# Altium schematic sheet uARM.SchDoc
size A
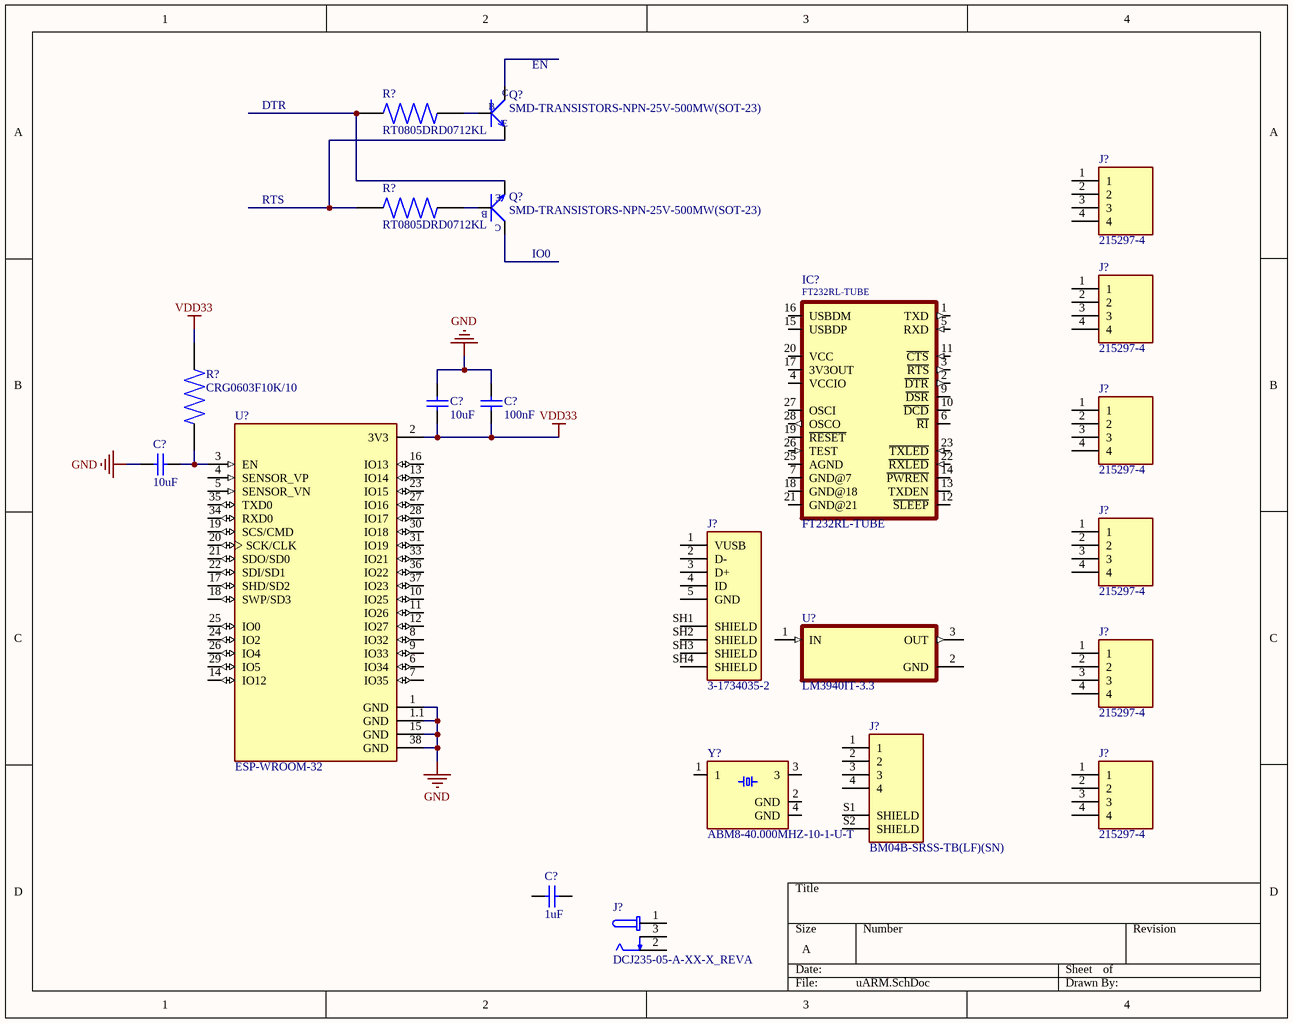
[diagram p0: uARM.SchDoc]

## Parts
(Parts that share a designator on the sheet are numbered #1, #2 ... from top to bottom, then left to right.)
C?#1  value 10uF  [C_3216[1206]_N]  (hidden comment: C1206C106K3RACTU)
C?#2  value 100nF  [C_3216[1206]_N]  (hidden comment: C1206C106K3RACTU)
C?#3  value 10uF  [C_3216[1206]_N]  (hidden comment: C1206C106K3RACTU)
C?#4  value 1uF  [C_3216[1206]_N]  (hidden comment: C1206C106K3RACTU)
IC?  FT232RL-TUBE  [SSOP28-LD]
J?#1  215297-4  [TE_215297-4]
J?#2  215297-4  [TE_215297-4]
J?#3  215297-4  [TE_215297-4]
J?#4  215297-4  [TE_215297-4]
J?#5  3-1734035-2  [TE_3-1734035-2]
J?#6  215297-4  [TE_215297-4]
J?#7  BM04B-SRSS-TB(LF)(SN)  [CONN_BM04B-SRSS-TB(LF)(SN)]
J?#8  215297-4  [TE_215297-4]
J?#9  DCJ235-05-A-XX-X_REVA  [GCT_DCJ235-05-A-XX-X_REVA]
Q?#1  SMD-TRANSISTORS-NPN-25V-500MW(SOT-23)  [SOT-23]
Q?#2  SMD-TRANSISTORS-NPN-25V-500MW(SOT-23)  [SOT-23]
R?#1  RT0805DRD0712KL  [RESC2012X60N]
R?#2  RT0805DRD0712KL  [RESC2012X60N]
R?#3  CRG0603F10K/10  [RESC1608X55N]
U?#1  ESP-WROOM-32  [MODULE_ESP-WROOM-32]
U?#2  LM3940IT-3.3  [TO254P1054X470X1955-3]
Y?  ABM8-40.000MHZ-10-1-U-T  [OSCSC320X250X100N]

## Nets
GND: C?#1.2 C?#2.2 C?#3.2 U?#1.1(GND) U?#1.1.1(GND) U?#1.15(GND) U?#1.38(GND)
VDD33: C?#1.1 C?#2.1 R?#3.2 U?#1.2(3V3)
NetC?#3_1: C?#3.1 R?#3.1 U?#1.3(EN)
NetQ?#1_1: Q?#1.1(B) R?#1.2
NetQ?#1_2: Q?#1.2(E) R?#2.1
NetQ?#2_1: Q?#2.1(B) R?#2.2
NetQ?#2_2: Q?#2.2(E) R?#1.1

Not connected (* = marked no-connect by the designer): C?#4 1 2; IC? 1(TXD) 2(~{DTR}) 3(~{RTS}) 4(VCCIO) 5(RXD) 6(~{RI}) 7(GND@7) 9(~{DSR}) 10(~{DCD}) 11(~{CTS}) 12(~{SLEEP}) 13(TXDEN) 14(~{PWREN}) 15(USBDP) 16(USBDM) 17(3V3OUT) 18(GND@18) 19(~{RESET}) 20(VCC) 21(GND@21) 22(~{RXLED}) 23(~{TXLED}) 25(AGND) 26(TEST) 27(OSCI) 28(OSCO); J?#1 1 2 3 4; J?#2 1 2 3 4; J?#3 1 2 3 4; J?#4 1 2 3 4; J?#5 1(VUSB) 2(D-) 3(D+) 4(ID) 5(GND) SH1(SHIELD) SH2(SHIELD) SH3(SHIELD) SH4(SHIELD); J?#6 1 2 3 4; J?#7 1 2 3 4 S1(SHIELD) S2(SHIELD); J?#8 1 2 3 4; J?#9 1 2 3; Q?#1 3(C); Q?#2 3(C); U?#1 4(SENSOR_VP) 5(SENSOR_VN) 6(IO34) 7(IO35) 8(IO32) 9(IO33) 10(IO25) 11(IO26) 12(IO27) 13(IO14) 14(IO12) 16(IO13) 17(SHD/SD2) 18(SWP/SD3) 19(SCS/CMD) 20(SCK/CLK) 21(SDO/SD0) 22(SDI/SD1) 23(IO15) 24(IO2) 25(IO0) 26(IO4) 27(IO16) 28(IO17) 29(IO5) 30(IO18) 31(IO19) 33(IO21) 34(RXD0) 35(TXD0) 36(IO22) 37(IO23); U?#2 1(IN) 2(GND) 3(OUT); Y? 1 2(GND) 3 4(GND)

## Notes on the sheet
- (near Q?#1) EN
- DTR
- RTS
- (near Q?#2) IO0

## Library data of the parts
C?#1-C?#4 = C_10uf_3216[1206]: Capacitor Céramique 10uf XR7 25V 10%; Manufacturer: KEMET; ManufacturerPartNumber: C1206C106K3RACTU; Supplier 1: Digi-Key; Supplier Part Number 1: 399-7442-1-ND; MountingType: SMT
IC? = FT232RL-TUBE: MF: {'manufacturer': u'FTDI,'}; Value: *; MP: FT232RL-TUBE; Availability: Unavailable; Price: None; Package: None
J?#1-J?#4 J?#6 J?#8 = 215297-4: MF: {'manufacturer': u'TE Connectivity'}; Package: None; Price: None; Availability: Unavailable; MP: 215297-4; Value: *
J?#5 = 3-1734035-2: USB Connectors MINI USB, R/A, SMT, MATTE TIN, W/O MYLAR; MF: {'manufacturer': u'TE Connectivity'}; Value: *; MP: 3-1734035-2; Availability: Unavailable; Price: None; Package: None
J?#7 = BM04B-SRSS-TB(LF)(SN): BM04B Series 1 mm Pitch 4 Position SMT Single Row Top Entry Shrouded Header; MF: {'manufacturer': u'JST Sales'}; Availability: Unavailable; Price: None; Value: *; MP: BM04B-SRSS-TB(LF)(SN); Package: None
J?#9 = DCJ235-05-A-XX-X_REVA: DC Power Jack, Thru-Hole, Horizontal, with Locating Pegs, D2.35mm; MF: {'manufacturer': u'Global Connector Technology'}; Availability: Unavailable; Package: None; Price: None; MP: DCJ235-05-A-XX-X_REVA; Value: *
Q?#1 Q?#2 = SMD-TRANSISTORS-NPN-25V-500MW(SOT-23): 305010017; MP: S8050; MF: {'manufacturer': u'Microdiode Electronics'}; Availability: Unavailable; Package: None; Value: *; Price: None
R?#1 R?#2 = RT0805DRD0712KL: RES SMD 12K OHM 0.5% 1/8W 0805; MF: {'manufacturer': u'Yageo'}; Price: None; Value: *; MP: RT0805DRD0712KL; Package: None; Availability: Unavailable
R?#3 = CRG0603F10K/10: Thick Film Resistors - SMD CRG0603 1% 10K 10K RL; MF: {'manufacturer': u'TE Connectivity'}; Value: *; Price: None; MP: CRG0603F10K/10; Package: None; Availability: Unavailable
U?#1 = ESP-WROOM-32: Module: combo; GPIO, I2C x2, I2S x2, SDIO, SPI x3, UART x3; 19.5dBm; MF: {'manufacturer': u'Espressif Systems'}; Availability: Unavailable; MP: ESP-WROOM-32; Value: *; Price: None; Package: None
U?#2 = LM3940IT-3.3: MF: {'manufacturer': u'Texas Instruments'}; Availability: Unavailable; MP: LM3940IT-3.3; Price: None; Value: *; Package: None
Y? = ABM8-40.000MHZ-10-1-U-T: Crystal 20MHz Ã‚Â±20ppm (Tol) Ã‚Â±30ppm (Stability) 18pF FUND 80Ohm 4-Pin Mini-CSMD T/R; MF: {'manufacturer': u'Abracon'}; Availability: Unavailable; Value: *; Package: None; MP: ABM8-40.000MHZ-10-1-U-T; Price: None